# Altium schematic sheet Sheet1.SchDoc
size A4; SheetNumber: 1; SheetTotal: 1
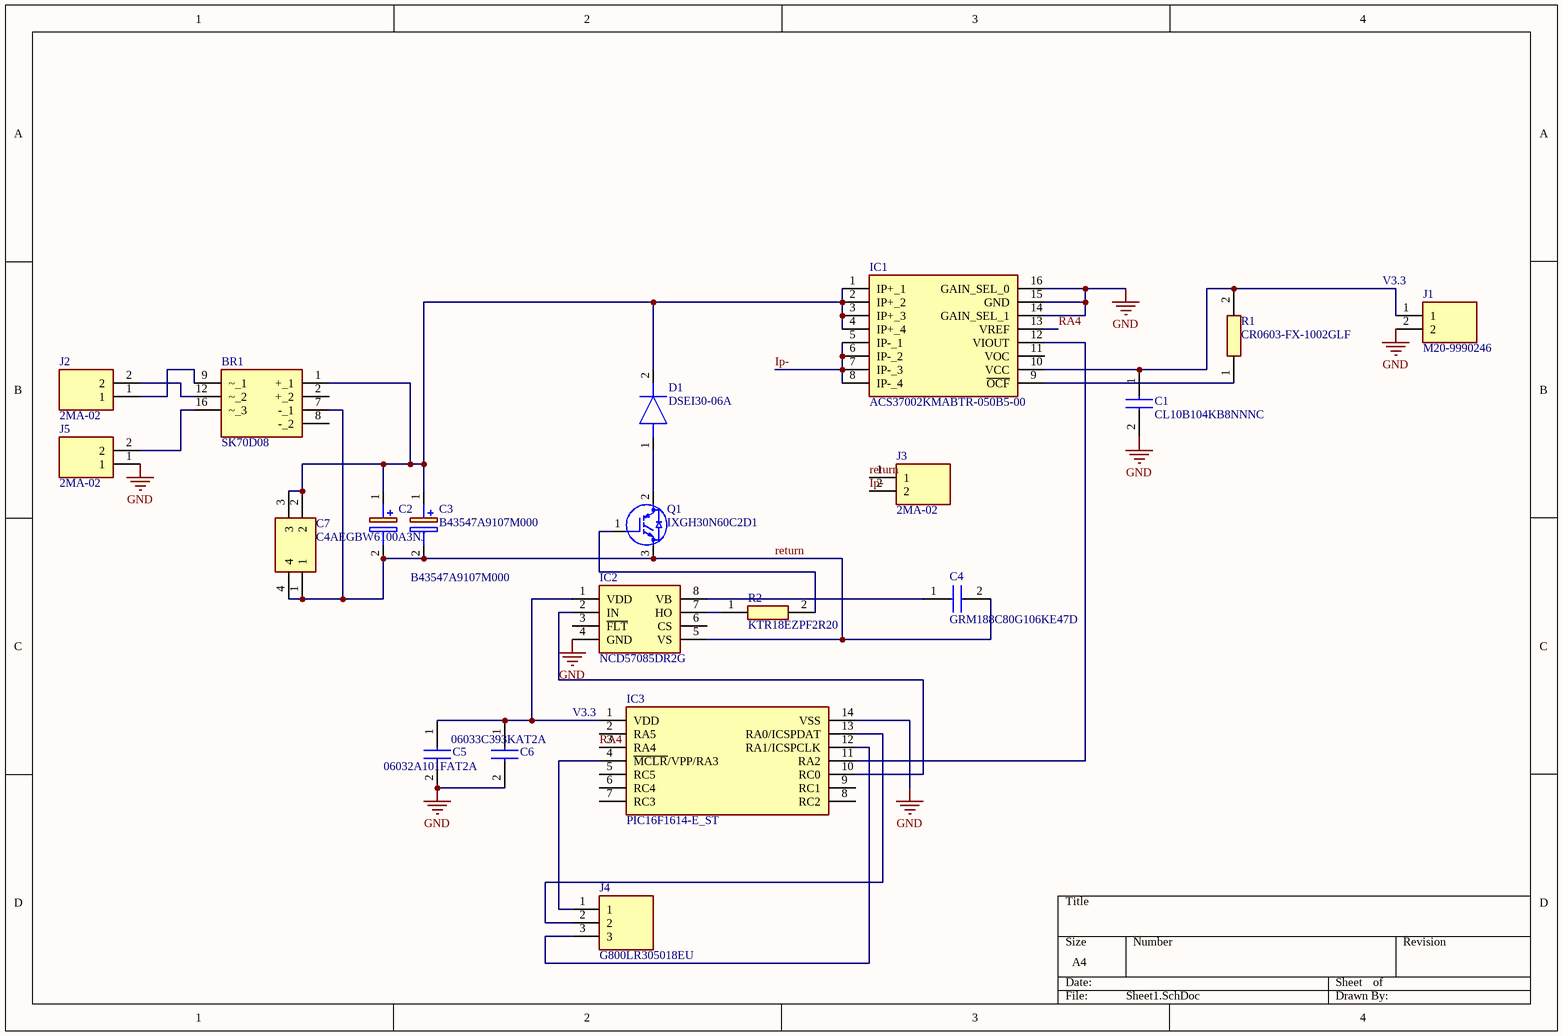
[diagram p0: Sheet1.SchDoc]

## Parts
BR1  SK70D08  [SK70D08]
C1  CL10B104KB8NNNC  [CAPC1608X90N]
C2  B43547A9107M000  [CAPPRD1000W190D2550H2700]
C3  B43547A9107M000  [CAPPRD1000W190D2550H2700]
C4  GRM188C80G106KE47D  [CAPC1608X90N]
C5  06032A101FAT2A  [CAPC1608X90N]
C6  06033C393KAT2A  [CAPC1608X90N]
C7  C4AEGBW6100A3NJ  [C4AEGBW6100A3NJ]
D1  DSEI30-06A  [TO1092P530X1586X2594-2P]
IC1  ACS37002KMABTR-050B5-00  [SOIC127P1030X265-16N]
IC2  NCD57085DR2G  [SOIC127P600X175-8N]
IC3  PIC16F1614-E_ST  [SOP65P640X120-14N]
J1  M20-9990246  [HDRV2W66P0X254_1X2_508X254X874P]
J2  2MA-02  [2MA02]
J3  2MA-02  [2MA02]
J4  G800LR305018EU  [HDRV3W64P0X254_1X3_762X250X1082P]
J5  2MA-02  [2MA02]
Q1  IXGH30N60C2D1  [IXGH30N60C2D1]
R1  CR0603-FX-1002GLF  [RESC1608X55N]
R2  KTR18EZPF2R20  [RESC3216X65N]

## Nets
GND: C1.2 C5.2 C6.2 IC1.14(GAIN_SEL_1) IC1.15(GND) IC1.16(GAIN_SEL_0) IC2.4(GND) IC3.14(VSS) J1.2 J5.1
Ip-: IC1.5(IP-_1) IC1.6(IP-_2) IC1.7(IP-_3) IC1.8(IP-_4) J3.2
RA4: IC1.13(VREF) IC3.3(RA4)
return: BR1.7(-_1) C2.2(-) C3.2(-) C4.2 C7.1 C7.4 IC2.5(VS) J3.1 Q1.3(E)
NetBR1_1: BR1.1(+_1) C2.1(+) C3.1(+) C7.2 C7.3 D1.2(K) IC1.1(IP+_1) IC1.2(IP+_2) IC1.3(IP+_3) IC1.4(IP+_4)
NetBR1_9: BR1.9(~_1) J2.1
NetBR1_12: BR1.12(~_2) J2.2
NetBR1_16: BR1.16(~_3) J5.2
NetC1_1: C1.1 IC1.10(VCC) J1.1 R1.2
NetC4_1: C4.1 IC2.8(VB)
NetC5_1: C5.1 C6.1 IC2.1(VDD) IC3.1(VDD)
NetD1_1: D1.1(A) Q1.2(C)
NetIC1_9: IC1.9(~{OCF}) R1.1
NetIC1_12: IC1.12(VIOUT) IC3.11(RA2)
NetIC2_2: IC2.2(IN) IC3.10(RC0)
NetIC2_7: IC2.7(HO) R2.1
NetIC3_4: IC3.4(~{MCLR}/VPP/RA3) J4.1
NetIC3_12: IC3.12(RA1/ICSPCLK) J4.3
NetIC3_13: IC3.13(RA0/ICSPDAT) J4.2
NetQ1_1: Q1.1(G) R2.2

Not connected (* = marked no-connect by the designer): BR1 2(+_2) 8(-_2); IC1 11(VOC); IC2 3(~{FLT}) 6(CS); IC3 2(RA5) 5(RC5) 6(RC4) 7(RC3) 8(RC2) 9(RC1)

## Notes on the sheet
- (near J1) V3.3
- (near IC3) V3.3

## Library data of the parts
BR1 = SK70D08: Bridge Rectifier; Manufacturer_Name: Semikron; Datasheet Link: https://shop.semikron-danfoss.com/thyristor-dioden-module/semitop-/sk-70-d-08.html; Height: 12mm; Manufacturer_Part_Number: SK70D08
C1 = CL10B104KB8NNNC: Capacitor; Manufacturer_Name: SAMSUNG; Datasheet Link: https://datasheet.datasheetarchive.com/originals/distributors/Datasheets-DGA10/2408969.pdf; Height: 0.9mm; Manufacturer_Part_Number: CL10B104KB8NNNC; Mouser Part Number: 187-CL10B104KB8NNNC; Mouser Price/Stock: https://www.mouser.co.uk/ProductDetail/Samsung-Electro-Mechanics/CL10B104KB8NNNC?qs=349EhDEZ59rvGc2rLwVOdA%3D%3D; Arrow Part Number: CL10B104KB8NNNC; Arrow Price/Stock: https://www.arrow.com/en/products/cl10b104kb8nnnc/samsung-electro-mechanics?region=nac
C2 C3 = B43547A9107M000: Capacitor Polarised; Manufacturer_Name: TDK; Datasheet Link: https://datasheet.datasheetarchive.com/originals/distributors/Datasheets_SAMA/cd912998c374446e8a207df35f28d060.pdf; Height: 27mm; Manufacturer_Part_Number: B43547A9107M000; Mouser Part Number: 871-B43547A9107M000; Mouser Price/Stock: https://www.mouser.co.uk/ProductDetail/EPCOS-TDK/B43547A9107M000?qs=OiaALIbqWFRvXNUybej1lA%3D%3D
C4 = GRM188C80G106KE47D: Capacitor; Manufacturer_Name: Murata Electronics; Datasheet Link: http://componentsearchengine.com/Datasheets/1/GRM188C80G106KE47D.pdf; Height: 0.9mm; Manufacturer_Part_Number: GRM188C80G106KE47D; Mouser Part Number: 81-GRM188C80G106KE7D; Mouser Price/Stock: https://www.mouser.co.uk/ProductDetail/Murata-Electronics/GRM188C80G106KE47D?qs=eeBpzGFlv%252B88kEI%2FLClYhQ%3D%3D; Arrow Part Number: GRM188C80G106KE47D; Arrow Price/Stock: https://www.arrow.com/en/products/grm188c80g106ke47d/murata-manufacturing?region=nac
C5 = 06032A101FAT2A: Capacitor; Manufacturer_Name: Kyocera AVX; Datasheet Link: https://au.mouser.com/datasheet/2/40/C0GNP0_KGM-3216332.pdf; Height: 0.9mm; Manufacturer_Part_Number: 06032A101FAT2A; Mouser Part Number: 581-06032A101FAT2A; Mouser Price/Stock: https://www.mouser.co.uk/ProductDetail/KYOCERA-AVX/06032A101FAT2A?qs=%252BdQmOuGyFcFRs1jGRy%252Bx8A%3D%3D
C6 = 06033C393KAT2A: Capacitor; Manufacturer_Name: Kyocera AVX; Datasheet Link: https://componentsearchengine.com/Datasheets/1/06031A100FAT2A.pdf; Height: 0.9mm; Manufacturer_Part_Number: 06033C393KAT2A; Mouser Part Number: 581-06033C393K; Mouser Price/Stock: https://www.mouser.com/Search/Refine.aspx?Keyword=581-06033C393K; Arrow Part Number: 06033C393KAT2A; Arrow Price/Stock: https://www.arrow.com/en/products/06033c393kat2a/avx
C7 = C4AEGBW6100A3NJ: Capacitor; Manufacturer_Name: NISSEI; Height: 50mm; Manufacturer_Part_Number: C4AEGBW6100A3NJ
D1 = DSEI30-06A: Diode; Manufacturer_Name: LITTELFUSE; Datasheet Link: https://componentsearchengine.com/Datasheets/1/DSEI30-06A.pdf; Height: 5.3mm; Manufacturer_Part_Number: DSEI30-06A; Mouser Part Number: 747-DSEI30-06A; Mouser Price/Stock: https://www.mouser.co.uk/ProductDetail/IXYS/DSEI30-06A?qs=t7yjd2JO%2FgQS8P%252B4%2Fp1LgQ%3D%3D; Arrow Part Number: DSEI30-06A; Arrow Price/Stock: https://www.arrow.com/en/products/dsei30-06a/littelfuse?region=europe
IC1 = ACS37002KMABTR-050B5-00: Integrated Circuit; Manufacturer_Name: Allegro Microsystems; Datasheet Link: https://www.allegromicro.com/en/products/sense/current-sensor-ics/zero-to-fifty-amp-integrated-conductor-sensor-ics/acs37002; Height: 2.65mm; Manufacturer_Part_Number: ACS37002KMABTR-050B5-00
IC2 = NCD57085DR2G: Integrated Circuit; Manufacturer_Name: onsemi; Datasheet Link: https://componentsearchengine.com/Datasheets/2/NCD57085DR2G.pdf; Height: 1.75mm; Manufacturer_Part_Number: NCD57085DR2G; Mouser Part Number: 863-NCD57085DR2G; Mouser Price/Stock: https://www.mouser.co.uk/ProductDetail/onsemi/NCD57085DR2G?qs=iLbezkQI%252Bsho7DsU0W3Vvg%3D%3D
IC3 = PIC16F1614-E_ST: Integrated Circuit; Manufacturer_Name: Microchip; Manufacturer_Part_Number: PIC16F1614-E/ST; Datasheet Link: http://www.microchip.com/mymicrochip/filehandler.aspx?ddocname=en572830; Height: 1.2mm; Mouser Part Number: 579-PIC16F1614-E/ST; Mouser Price/Stock: https://www.mouser.co.uk/ProductDetail/Microchip-Technology/PIC16F1614-E-ST?qs=7PCaVhlmG1qOwWgwKHE1Tg%3D%3D; Arrow Part Number: PIC16F1614-E/ST; Arrow Price/Stock: https://www.arrow.com/en/products/pic16f1614-est/microchip-technology
J1 = M20-9990246: Connector; Manufacturer_Name: Harwin; Datasheet Link: https://cdn.harwin.com/pdfs/M20-999.pdf; Height: 8.74mm; Manufacturer_Part_Number: M20-9990246; Mouser Part Number: 855-M20-9990246; Mouser Price/Stock: https://www.mouser.co.uk/ProductDetail/Harwin/M20-9990246?qs=Jph8NoUxIfWjw4WmyRvzag%3D%3D
J2 J3 J5 = 2MA-02: Connector; Manufacturer_Name: TE Connectivity; Datasheet Link: https://octopart.com/datasheet/2ma-02-te+connectivity-39650644; Height: 15.3mm; Manufacturer_Part_Number: 2MA-02; Mouser Part Number: 571-15460742; Mouser Price/Stock: https://www.mouser.co.uk/ProductDetail/TE-Connectivity/2MA-02?qs=tYnqtB6%252BMT5HYbRtwiMoEw%3D%3D
J4 = G800LR305018EU: Connector; Manufacturer_Name: Amphenol Communications Solutions; Datasheet Link: https://cdn.amphenol-cs.com/media/wysiwyg/files/documentation/datasheet/boardwiretoboard/bwb_agilbrick_2_54mm_btb_header_g800.pdf; Height: 10.82mm; Manufacturer_Part_Number: G800LR305018EU; Mouser Part Number: 523-G800LR305018EU; Mouser Price/Stock: https://www.mouser.co.uk/ProductDetail/Amphenol-Commercial-Products/G800LR305018EU?qs=PzGy0jfpSMsZaVkTJmYyRA%3D%3D
Q1 = IXGH30N60C2D1: Transistor IGBT; Manufacturer_Name: LITTELFUSE; Datasheet Link: https://pdf1.alldatasheet.com/datasheet-pdf/download/415159/IXYS/IXGH30N60C2D1.html; Height: 25.96mm; Manufacturer_Part_Number: IXGH30N60C2D1
R1 = CR0603-FX-1002GLF: Resistor; Manufacturer_Name: Bourns; Datasheet Link: https://www.bourns.com/pdfs/chpreztr.pdf; Height: 0.55mm; Manufacturer_Part_Number: CR0603-FX-1002GLF; Mouser Part Number: 652-CR0603FX-1002GLF; Mouser Price/Stock: https://www.mouser.com/Search/Refine.aspx?Keyword=652-CR0603FX-1002GLF; Arrow Part Number: CR0603-FX-1002GLF; Arrow Price/Stock: https://www.arrow.com/en/products/cr0603-fx-1002glf/bourns
R2 = KTR18EZPF2R20: Resistor; Manufacturer_Name: ROHM Semiconductor; Datasheet Link: http://rohmfs.rohm.com/en/products/databook/datasheet/passive/resistor/chip_resistor/ktr.pdf; Height: 0.65mm; Manufacturer_Part_Number: KTR18EZPF2R20; Mouser Part Number: 755-KTR18EZPF2R20; Mouser Price/Stock: https://www.mouser.co.uk/ProductDetail/ROHM-Semiconductor/KTR18EZPF2R20?qs=Y0Uzf4wQF3nRNQ%2FJtyiNSA%3D%3D